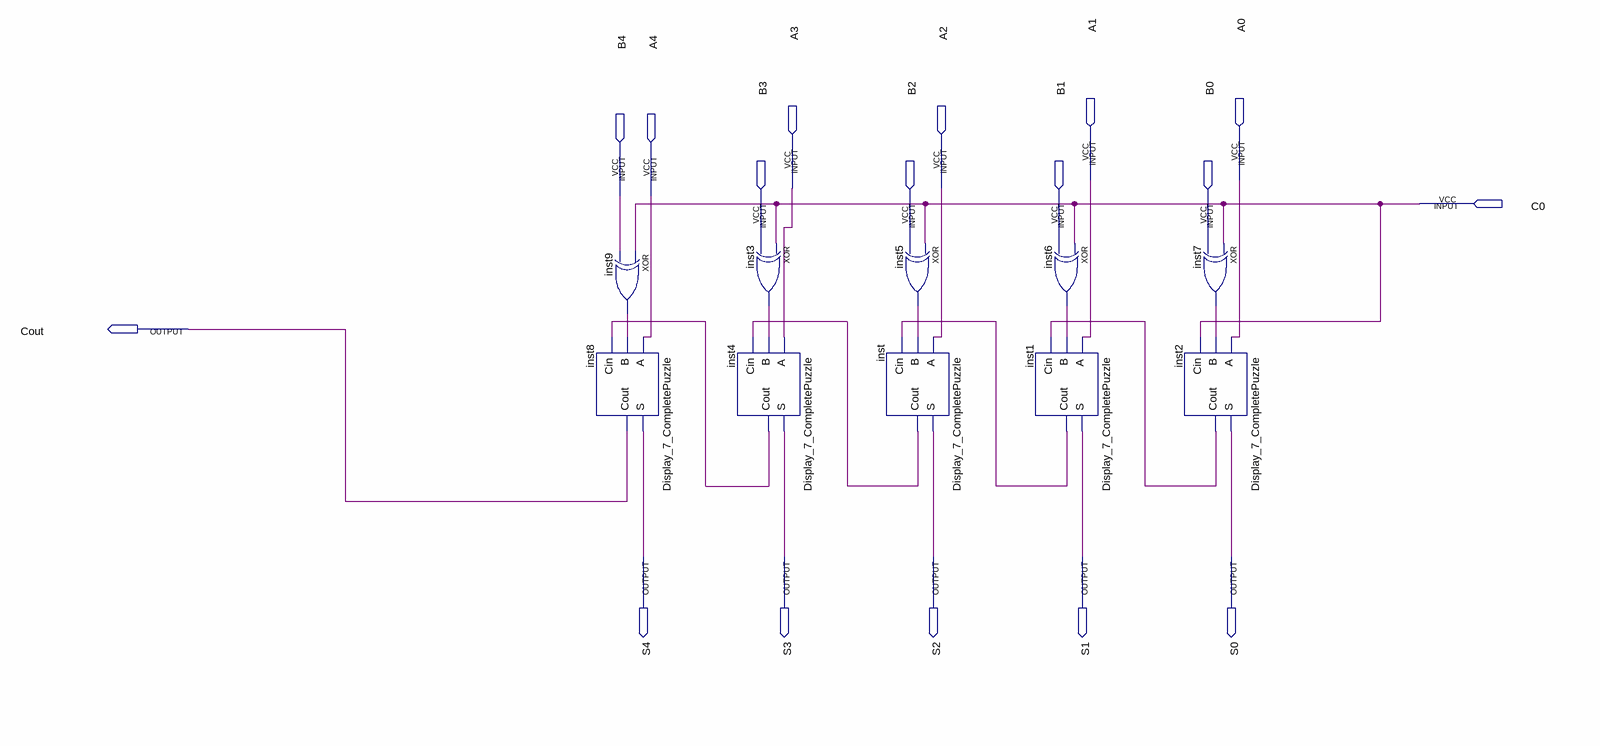
[diagram p0: schematic sheet]
// Quartus schematic somadorsub5bit.bdf as structural Verilog: 10 symbols, 17 pins
module somadorsub5bit (
  input  A1,
  input  A0,
  input  A3,
  input  A2,
  input  B4,
  input  A4,
  input  C0,
  input  B3,
  input  B2,
  input  B1,
  input  B0,
  output Cout,
  output S4,
  output S3,
  output S2,
  output S1,
  output S0
);

  wire inst1_cout, inst2_cout, inst3_out, inst4_cout, inst5_out, inst6_out, inst7_out, inst9_out, inst_cout;

  xor inst9 (inst9_out, C0, B4);
  Display_7_CompletePuzzle inst8 (.A(A4), .B(inst9_out), .Cin(inst4_cout), .S(S4), .Cout(Cout));
  Display_7_CompletePuzzle inst4 (.A(A3), .B(inst3_out), .Cin(inst_cout), .S(S3), .Cout(inst4_cout));
  xor inst3 (inst3_out, C0, B3);
  xor inst5 (inst5_out, C0, B2);
  Display_7_CompletePuzzle inst (.A(A2), .B(inst5_out), .Cin(inst1_cout), .S(S2), .Cout(inst_cout));
  xor inst6 (inst6_out, C0, B1);
  Display_7_CompletePuzzle inst1 (.A(A1), .B(inst6_out), .Cin(inst2_cout), .S(S1), .Cout(inst1_cout));
  Display_7_CompletePuzzle inst2 (.A(A0), .B(inst7_out), .Cin(C0), .S(S0), .Cout(inst2_cout));
  xor inst7 (inst7_out, C0, B0);
endmodule
